# Altium schematic sheet Block Diagram.SchDoc
size A; SheetNumber: 2; SheetTotal: 18
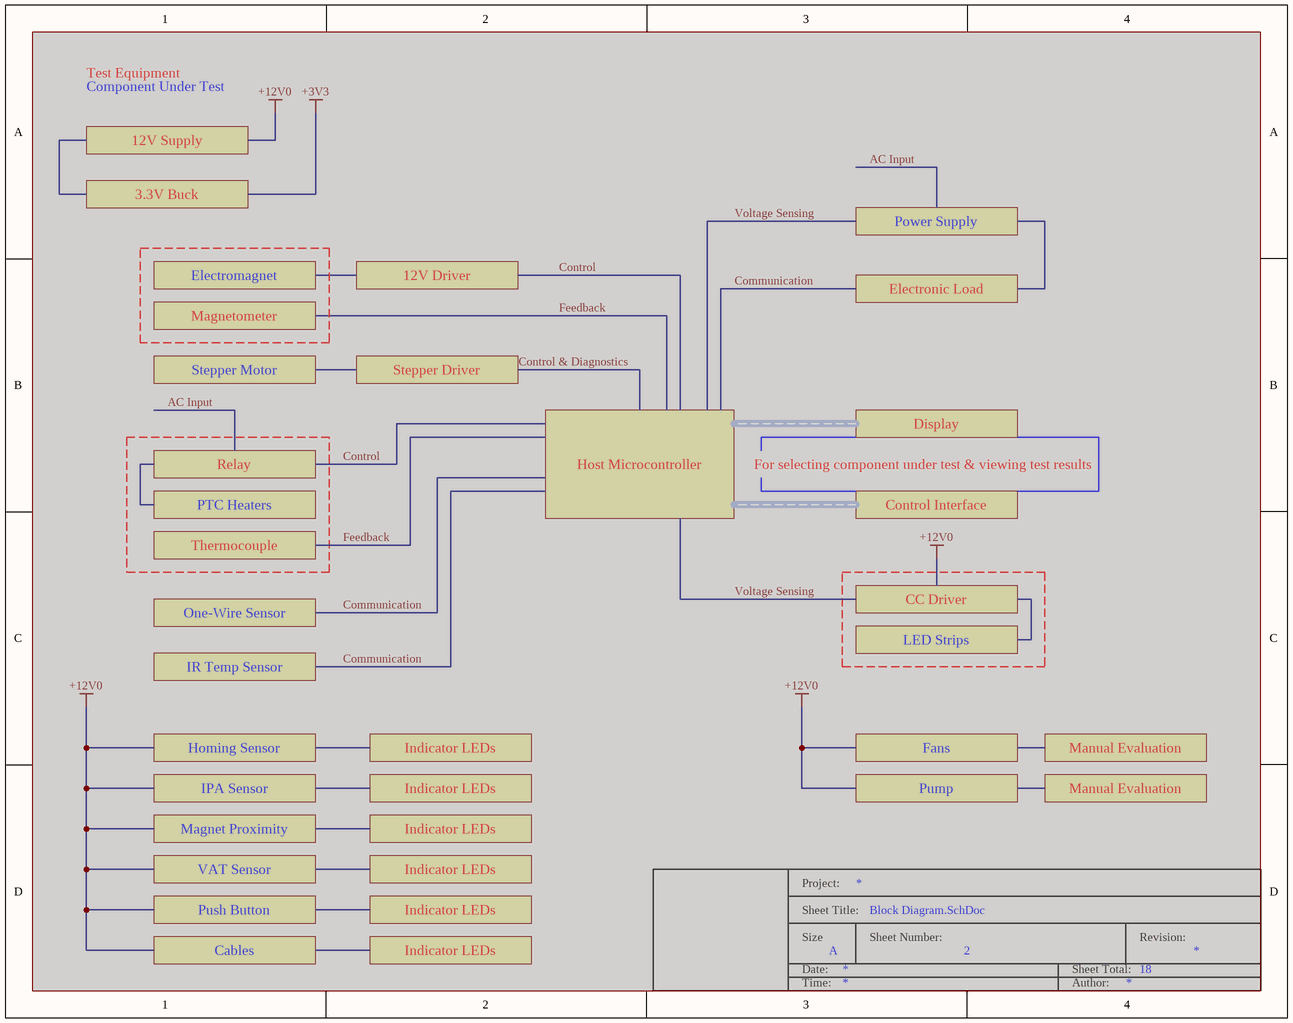
[diagram p0: Block Diagram.SchDoc]

## Notes on the sheet
- Test Equipment
- Component Under Test
- 12V Supply
- 3.3V Buck
- Power Supply
- Electromagnet
- 12V Driver
- Electronic Load
- Stepper Motor
- Magnetometer
- Stepper Driver
- Display
- PTC Heaters
- Relay
- Host Microcontroller
- For selecting component under test & viewing test results
- Control Interface
- Thermocouple
- One-Wire Sensor
- LED Strips
- CC Driver
- IR Temp Sensor
- Homing Sensor
- Indicator LEDs
- Fans
- Manual Evaluation
- IPA Sensor
- Magnet Proximity
- Pump
- VAT Sensor
- Push Button
- Cables
- Project:
- Sheet Title:
- Size
- Date:
- A
- Sheet Number:
- Sheet Total:
- Revision:
- Time:
- Author: